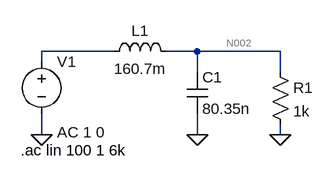
[diagram p0: schematic Ej1-1db.asc]
Ej1-1db.asc, the LTspice schematic file:
Version 4
SHEET 1 880 680
WIRE 48 128 -64 128
WIRE 176 128 128 128
WIRE 304 128 176 128
WIRE -64 144 -64 128
WIRE 176 160 176 128
WIRE 304 160 304 128
WIRE -64 256 -64 224
WIRE 176 256 176 224
WIRE 304 256 304 240
FLAG -64 256 0
FLAG 176 256 0
FLAG 304 256 0
SYMBOL ind 32 144 R270
WINDOW 0 32 56 VTop 2
WINDOW 3 5 56 VBottom 2
SYMATTR InstName L1
SYMATTR Value 160.7m
SYMBOL cap 160 160 R0
SYMATTR InstName C1
SYMATTR Value 80.35n
SYMBOL res 288 144 R0
SYMATTR InstName R1
SYMATTR Value 1k
SYMBOL voltage -64 128 R0
WINDOW 123 24 124 Left 2
WINDOW 39 0 0 Left 0
SYMATTR Value2 AC 1 0
SYMATTR InstName V1
SYMATTR Value ""
TEXT -96 280 Left 2 !.ac lin 100 1 6k

The netlist it stands for:
* Ej1-1db.asc
L1 N001 N002 160.7m
C1 N002 0 80.35n
R1 N002 0 1k
V1 N001 0 AC 1 0
.ac lin 100 1 6k
.backanno
.end

* Results of the author's LTspice run, read from the files saved beside the schematic
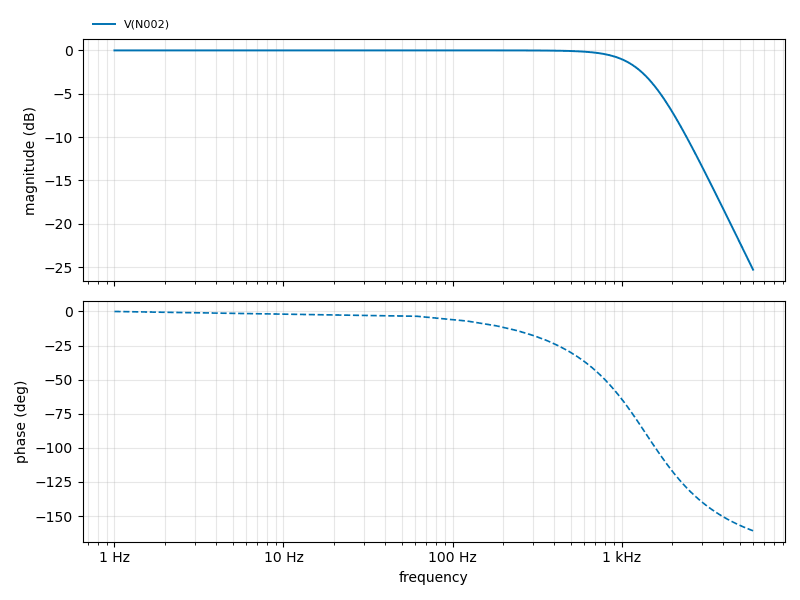
[diagram p1: AC Analysis of Ej1-1db.asc, plotted from the saved traces]
* AC Analysis, 1 run:
*   V(N002): -0.00 dB at 1 Hz, -25.29 dB at 6 kHz, peak -0.00 dB at 1 Hz, 3 dB below the peak at 1.4 kHz